# EAGLE schematic led circuits (EAGLE 6.4)
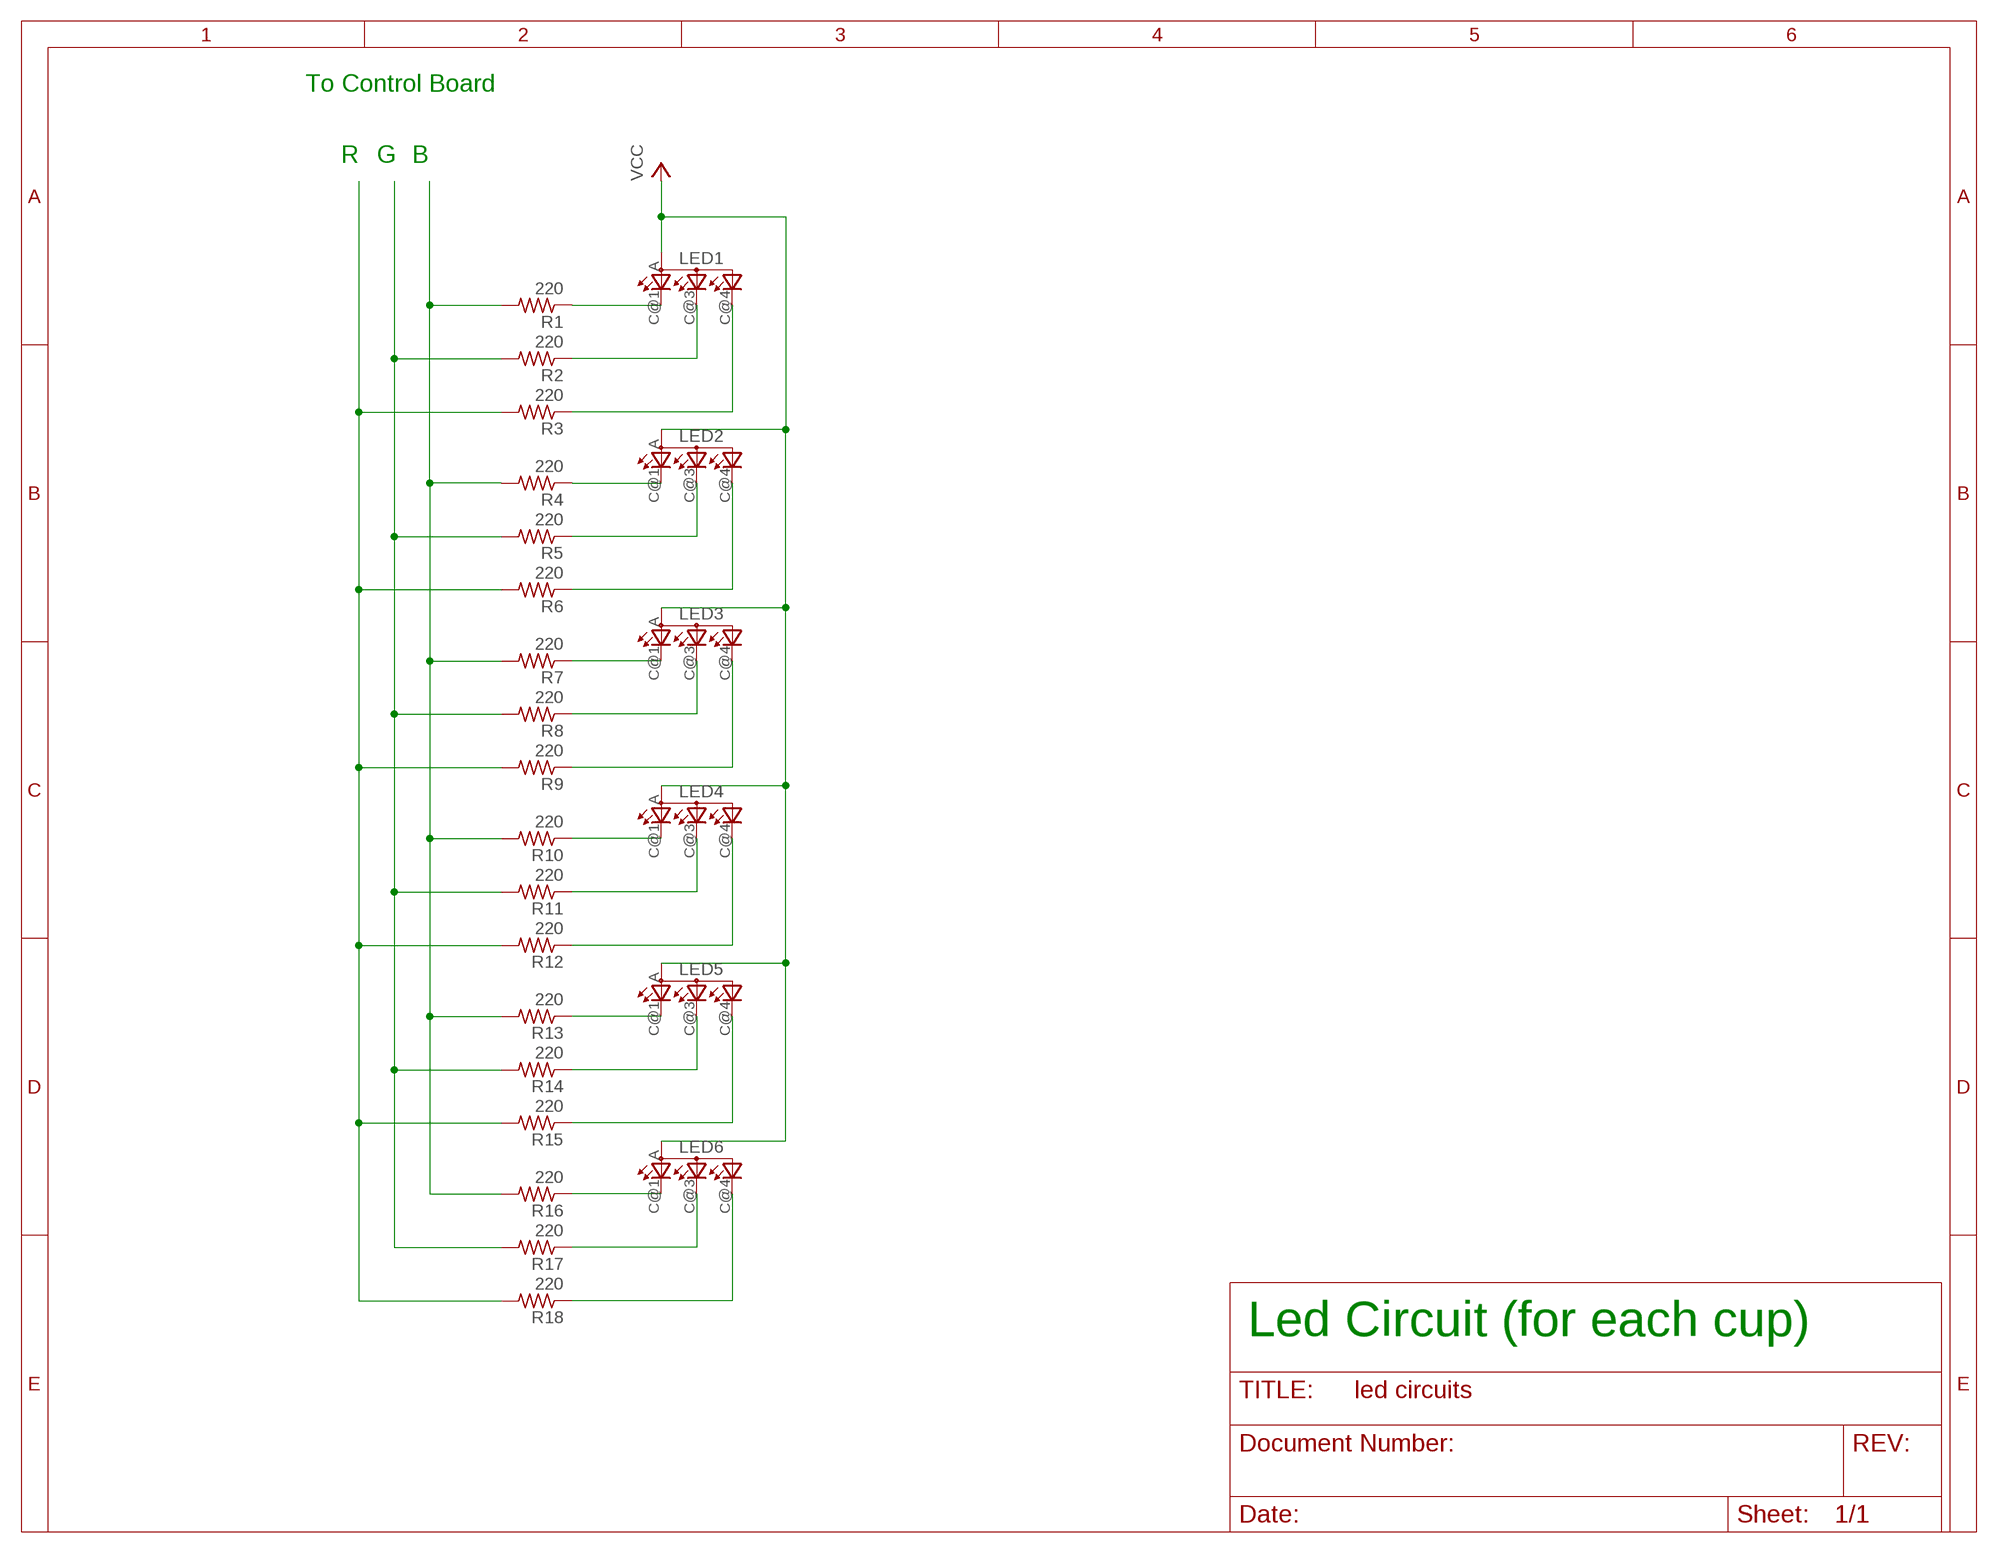
[diagram p0: schematic, sheet 1]

## Parts
LED1  TOPLED-3P-LCC-4  [P-LCC-4]
LED2  TOPLED-3P-LCC-4  [P-LCC-4]
LED3  TOPLED-3P-LCC-4  [P-LCC-4]
LED4  TOPLED-3P-LCC-4  [P-LCC-4]
LED5  TOPLED-3P-LCC-4  [P-LCC-4]
LED6  TOPLED-3P-LCC-4  [P-LCC-4]
R1  220  R-US_0207/2V  [0207/2V]
R2  220  R-US_0207/2V  [0207/2V]
R3  220  R-US_0207/2V  [0207/2V]
R4  220  R-US_0207/2V  [0207/2V]
R5  220  R-US_0207/2V  [0207/2V]
R6  220  R-US_0207/2V  [0207/2V]
R7  220  R-US_0207/2V  [0207/2V]
R8  220  R-US_0207/2V  [0207/2V]
R9  220  R-US_0207/2V  [0207/2V]
R10  220  R-US_0207/2V  [0207/2V]
R11  220  R-US_0207/2V  [0207/2V]
R12  220  R-US_0207/2V  [0207/2V]
R13  220  R-US_0207/2V  [0207/2V]
R14  220  R-US_0207/2V  [0207/2V]
R15  220  R-US_0207/2V  [0207/2V]
R16  220  R-US_0207/2V  [0207/2V]
R17  220  R-US_0207/2V  [0207/2V]
R18  220  R-US_0207/2V  [0207/2V]

## Nets
N$1: LED1.C@1(CRED) R1.1
N$2: LED1.C@3(CBLUE) R2.1
N$3: LED1.C@4(CGREEN) R3.1
N$4: LED2.C@1(CRED) R4.1
N$5: LED2.C@3(CBLUE) R5.1
N$6: LED2.C@4(CGREEN) R6.1
N$7: LED3.C@1(CRED) R7.1
N$8: LED3.C@3(CBLUE) R8.1
N$9: LED3.C@4(CGREEN) R9.1
N$10: LED4.C@1(CRED) R10.1
N$11: LED4.C@3(CBLUE) R11.1
N$12: LED4.C@4(CGREEN) R12.1
N$13: LED5.C@1(CRED) R13.1
N$14: LED5.C@3(CBLUE) R14.1
N$15: LED5.C@4(CGREEN) R15.1
N$16: LED6.C@1(CRED) R16.1
N$17: LED6.C@3(CBLUE) R17.1
N$18: LED6.C@4(CGREEN) R18.1
N$19: R1.2 R4.2 R7.2 R10.2 R13.2 R16.2
N$20: R2.2 R5.2 R8.2 R11.2 R14.2 R17.2
N$21: R3.2 R6.2 R9.2 R12.2 R15.2 R18.2
VCC: LED1.A(A2) LED2.A(A2) LED3.A(A2) LED4.A(A2) LED5.A(A2) LED6.A(A2)

## Notes on the sheet
- To Control Board
- R | G | B
- Led Circuit (for each cup)

## Library data of the parts
LED1-LED6 = led:TOPLED-3: OSRAM - Hyper Multi TOPLED® (RGB) LB E673, LV E673, LT E673 - Power TOPLED® Enhanced optical Power LED (HOP2000) LS E67B, LA E67B, LO E67B, LY E67B - Hyper Multi TOPLED® Enhanced optical Power LED (HOP2000 / ATON®) LATB T66B - Hyper Multi TOPLED® Hyper-Bright LED LATB T686 Source: http://www.osram.convergy.de/
R1-R18 = resistor:R-US_: RESISTOR, American symbol